# EasyEDA schematic SCH_strip-table_2023-05-29.json
TITLE: Sheet_1; REV: 1.0; Date: 2022-05-19; Sheet: 1/1; Drawn By: MusT.W; Company: Your Company
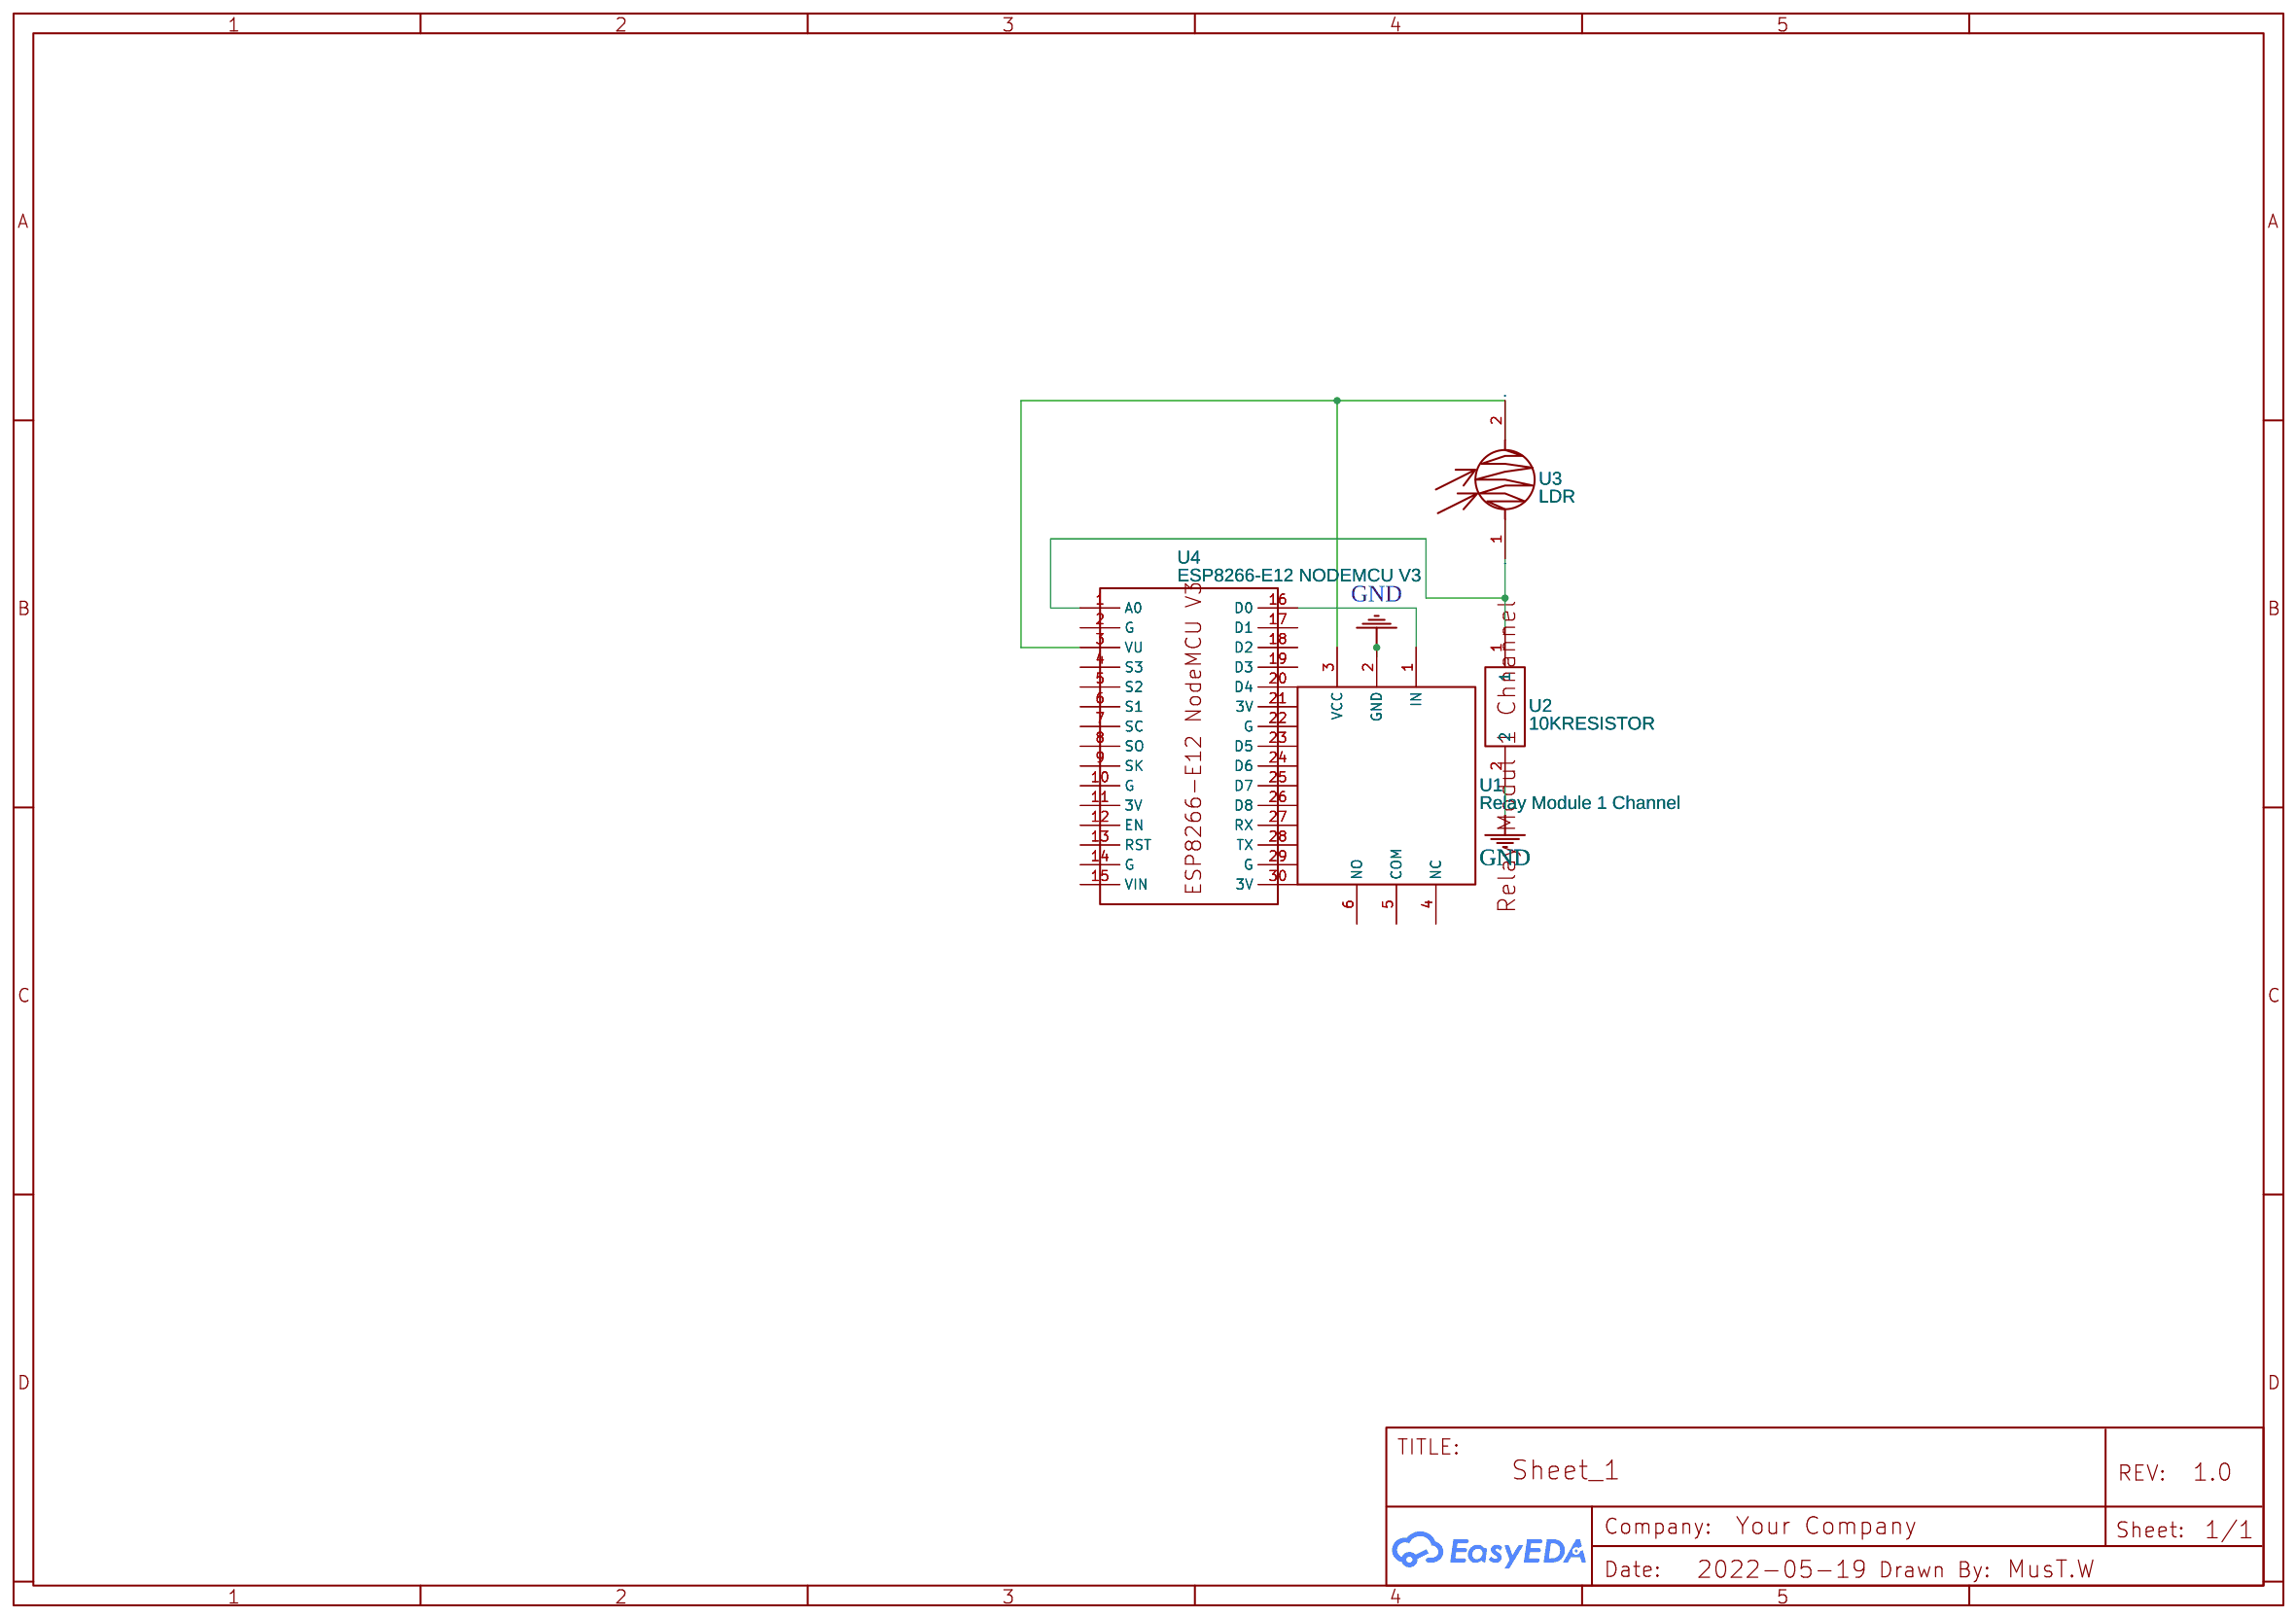
[diagram p0: schematic sheet]

## Parts
U1  Relay Module 1 Channel  [RELAY MODULE HW-279 2 RELAYS]
U2  10KRESISTOR  [10KRESISTOR]
U3  LDR  [LDR]
U4  ESP8266-E12 NODEMCU V3  [ESP8266-E12-NODEMCU-V3]

## Library data of the parts
U1 = Relay Module 1 Channel: Manufacturer Part: Relay Module hw-279 2 relays; Contributor: Haramu4a
U2 = 10KRESISTOR: Manufacturer: MULTICOMP PRO; Manufacturer Part: MCMF0W4DF1002A50; Supplier Part: 1563077; Supplier: Element14; link: https://au.element14.com/multicomp/mcmf0w4df1002a50/res-10k-0-50-250mw-axial/dp/1563077; Contributor: alexandriamckie
U3 = LDR: Contributor: PatoViejo
U4 = ESP8266-E12 NODEMCU V3: Contributor: sigmur

## Nets
GND: U1.2(GND) U2.2
Net-(U1-1): U1.1(IN) U4.16(D0)
Net-(U1-3): U1.3(VCC) U3.2 U4.3(VU)
Net-(U2-1): U2.1 U3.1 U4.1(A0)

Not connected (* = marked no-connect by the designer): U1 4(NC) 5(COM) 6(NO); U4 2(G) 4(S3) 5(S2) 6(S1) 7(SC) 8(SO) 9(SK) 10(G) 11(3V) 12(EN) 13(RST) 14(G) 15(VIN) 17(D1) 18(D2) 19(D3) 20(D4) 21(3V) 22(G) 23(D5) 24(D6) 25(D7) 26(D8) 27(RX) 28(TX) 29(G) 30(3V)
